# Altium schematic sheet HDMI_MIPI-DSI_EDP.SchDoc
size A4; SheetNumber: 9; SheetTotal: 26
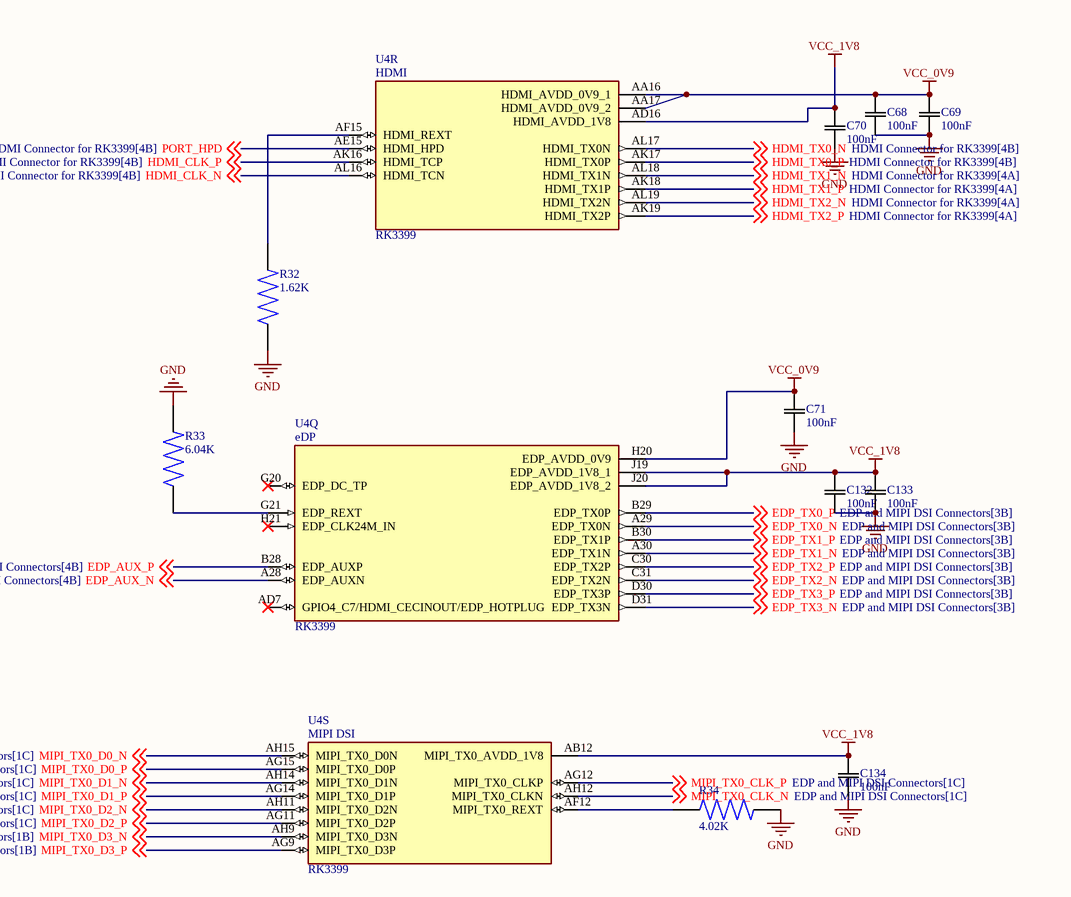
[diagram p0: HDMI_MIPI-DSI_EDP.SchDoc]

## Parts
C68  100nF  [CAP_1005_TDK]
C69  100nF  [CAP_1005_TDK]
C70  100nF  [CAP_1005_TDK]
C71  100nF  [CAP_1005_TDK]
C132  100nF  [CAP_1005_TDK]
C133  100nF  [CAP_1005_TDK]
C134  100nF  [CAP_1005_TDK]
R32  1.62K  [RES_ERA8APB1621V]
R33  6.04K  [RES_ERA8ARB6041V]
R34  4.02K  [RES_ERJP06F4021V]
U4  RK3399  [BGA828C65P31X31_2100X2100X161N]  (parts Q,R,S of 32)

## Nets
GND: C68.2 C69.2 C70.2 C71.2 C132.2 C133.2 C134.2 R32.1 R33.2 R34.2
VCC_0V9: C68.1 C69.1 C71.1 U4.AA16(HDMI_AVDD_0V9_1) U4.AA17(HDMI_AVDD_0V9_2) U4.H20(EDP_AVDD_0V9)
VCC_1V8: C70.1 C132.1 C133.1 C134.1 U4.AB12(MIPI_TX0_AVDD_1V8) U4.AD16(HDMI_AVDD_1V8) U4.J19(EDP_AVDD_1V8_1) U4.J20(EDP_AVDD_1V8_2)
EDP_AUX_N: U4.A28(EDP_AUXN) ; off-sheet EDP_AUX_N
EDP_AUX_P: U4.B28(EDP_AUXP) ; off-sheet EDP_AUX_P
EDP_TX0_N: U4.A29(EDP_TX0N) ; off-sheet EDP_TX0_N
EDP_TX0_P: U4.B29(EDP_TX0P) ; off-sheet EDP_TX0_P
EDP_TX1_N: U4.A30(EDP_TX1N) ; off-sheet EDP_TX1_N
EDP_TX1_P: U4.B30(EDP_TX1P) ; off-sheet EDP_TX1_P
EDP_TX2_N: U4.C31(EDP_TX2N) ; off-sheet EDP_TX2_N
EDP_TX2_P: U4.C30(EDP_TX2P) ; off-sheet EDP_TX2_P
EDP_TX3_N: U4.D31(EDP_TX3N) ; off-sheet EDP_TX3_N
EDP_TX3_P: U4.D30(EDP_TX3P) ; off-sheet EDP_TX3_P
HDMI_CLK_N: U4.AL16(HDMI_TCN) ; off-sheet HDMI_CLK_N
HDMI_CLK_P: U4.AK16(HDMI_TCP) ; off-sheet HDMI_CLK_P
HDMI_TX0_N: U4.AL17(HDMI_TX0N) ; off-sheet HDMI_TX0_N
HDMI_TX0_P: U4.AK17(HDMI_TX0P) ; off-sheet HDMI_TX0_P
HDMI_TX1_N: U4.AL18(HDMI_TX1N) ; off-sheet HDMI_TX1_N
HDMI_TX1_P: U4.AK18(HDMI_TX1P) ; off-sheet HDMI_TX1_P
HDMI_TX2_N: U4.AL19(HDMI_TX2N) ; off-sheet HDMI_TX2_N
HDMI_TX2_P: U4.AK19(HDMI_TX2P) ; off-sheet HDMI_TX2_P
MIPI_TX0_CLK_N: U4.AH12(MIPI_TX0_CLKN) ; off-sheet MIPI_TX0_CLK_N
MIPI_TX0_CLK_P: U4.AG12(MIPI_TX0_CLKP) ; off-sheet MIPI_TX0_CLK_P
MIPI_TX0_D0_N: U4.AH15(MIPI_TX0_D0N) ; off-sheet MIPI_TX0_D0_N
MIPI_TX0_D0_P: U4.AG15(MIPI_TX0_D0P) ; off-sheet MIPI_TX0_D0_P
MIPI_TX0_D1_N: U4.AH14(MIPI_TX0_D1N) ; off-sheet MIPI_TX0_D1_N
MIPI_TX0_D1_P: U4.AG14(MIPI_TX0_D1P) ; off-sheet MIPI_TX0_D1_P
MIPI_TX0_D2_N: U4.AH11(MIPI_TX0_D2N) ; off-sheet MIPI_TX0_D2_N
MIPI_TX0_D2_P: U4.AG11(MIPI_TX0_D2P) ; off-sheet MIPI_TX0_D2_P
MIPI_TX0_D3_N: U4.AH9(MIPI_TX0_D3N) ; off-sheet MIPI_TX0_D3_N
MIPI_TX0_D3_P: U4.AG9(MIPI_TX0_D3P) ; off-sheet MIPI_TX0_D3_P
PORT_HPD: U4.AE15(HDMI_HPD) ; off-sheet PORT_HPD
NetR32_2: R32.2 U4.AF15(HDMI_REXT)
NetR33_1: R33.1 U4.G21(EDP_REXT)
NetR34_1: R34.1 U4.AF12(MIPI_TX0_REXT)

Not connected (* = marked no-connect by the designer): U4 AD7(GPIO4_C7/HDMI_CECINOUT/EDP_HOTPLUG)* G20(EDP_DC_TP)* H21(EDP_CLK24M_IN)*

## Notes on the sheet
- (in symbol RK3399, part Q) eDP
- (in symbol RK3399, part R) HDMI
- (in symbol RK3399, part S) MIPI DSI

## Library data of the parts
C68-C71 C132-C134 = C1005X7R1H104M050BB: Description; Manufacturer_Name: TDK; Copyright: Copyright (C) 2025 Ultra Librarian. All rights reserved.; Manufacturer_Part_Number: C1005X7R1H104M050BB
R32 = ERA8APB1621V: Value: *; Price: None; Availability: Unavailable; Package: None; MP: ERA8APB1621V
R33 = ERA8ARB6041V: Package: None; MP: ERA8ARB6041V; Value: *; Availability: Unavailable; Price: None
R34 = ERJP06F4021V: Price: None; Value: *; Availability: Unavailable; Package: None; MP: ERJP06F4021V
U4 = RK3399: RK3399 ROCK Pi 4 Model A 2GB - ARMÂ® CortexÂ®-A53, CortexÂ®-A72 MPU Embedded Evaluation Board; MF: Rockchip; SnapEDA_Link: https://www.snapeda.com/parts/RK3399/Fuzhou+Rockchip+Electronics+Co/view-part/?ref=snap; Package: Seeed Technology; MP: RK3399; Check_prices: https://www.snapeda.com/parts/RK3399/Fuzhou+Rockchip+Electronics+Co/view-part/?ref=eda; Price: None; Value: *; Availability: Not in stock